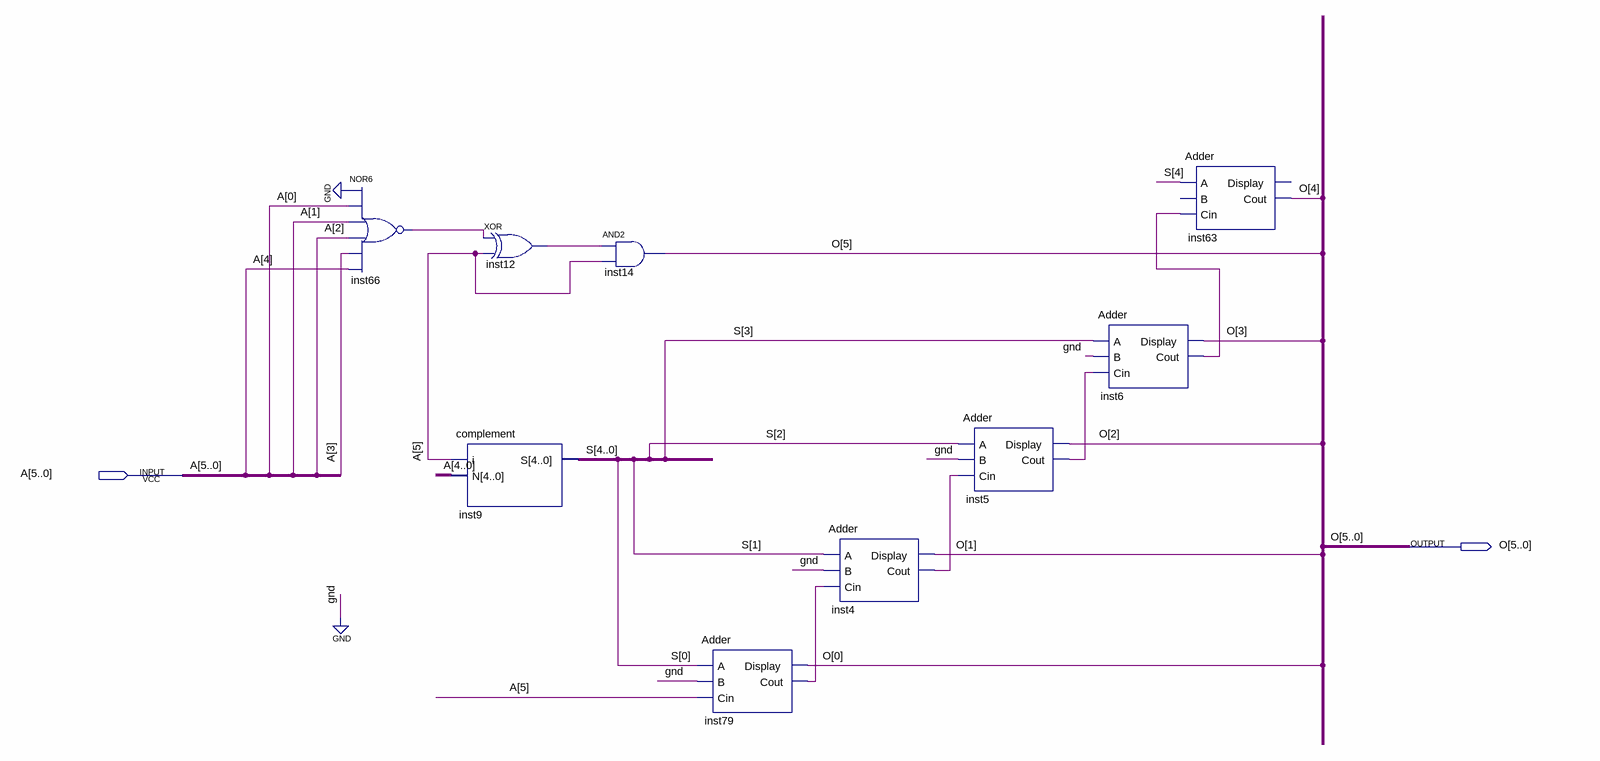
[diagram p0: schematic sheet]
// Quartus schematic AURA3.bdf as structural Verilog: 9 symbols, 2 pins
module AURA3 (
  input  [5:0] A,
  output [5:0] O
);

  wire inst4_cout, inst5_cout, inst6_cout, inst12_out, inst66_out, inst79_cout;
  wire [4:0] S;

  nor inst66 (inst66_out, 1'b0, A[0], A[1], A[2], A[3], A[4]);
  complement inst9 (.i(A[5]), .N(A[4:0]), .S(S));
  xor inst12 (inst12_out, inst66_out, A[5]);
  and inst14 (O[5], inst12_out, A[5]);
  Adder inst79 (.A(S[0]), .B(1'b0), .Cin(A[5]), .Display(O[0]), .Cout(inst79_cout));
  Adder inst4 (.A(S[1]), .B(1'b0), .Cin(inst79_cout), .Display(O[1]), .Cout(inst4_cout));
  Adder inst5 (.A(S[2]), .B(1'b0), .Cin(inst4_cout), .Display(O[2]), .Cout(inst5_cout));
  Adder inst6 (.A(S[3]), .B(1'b0), .Cin(inst5_cout), .Display(O[3]), .Cout(inst6_cout));
  Adder inst63 (.A(S[4]), .Cin(inst6_cout), .Cout(O[4]));  // open: B, Display
endmodule
